# Altium project 数字电路时钟.PrjPcb
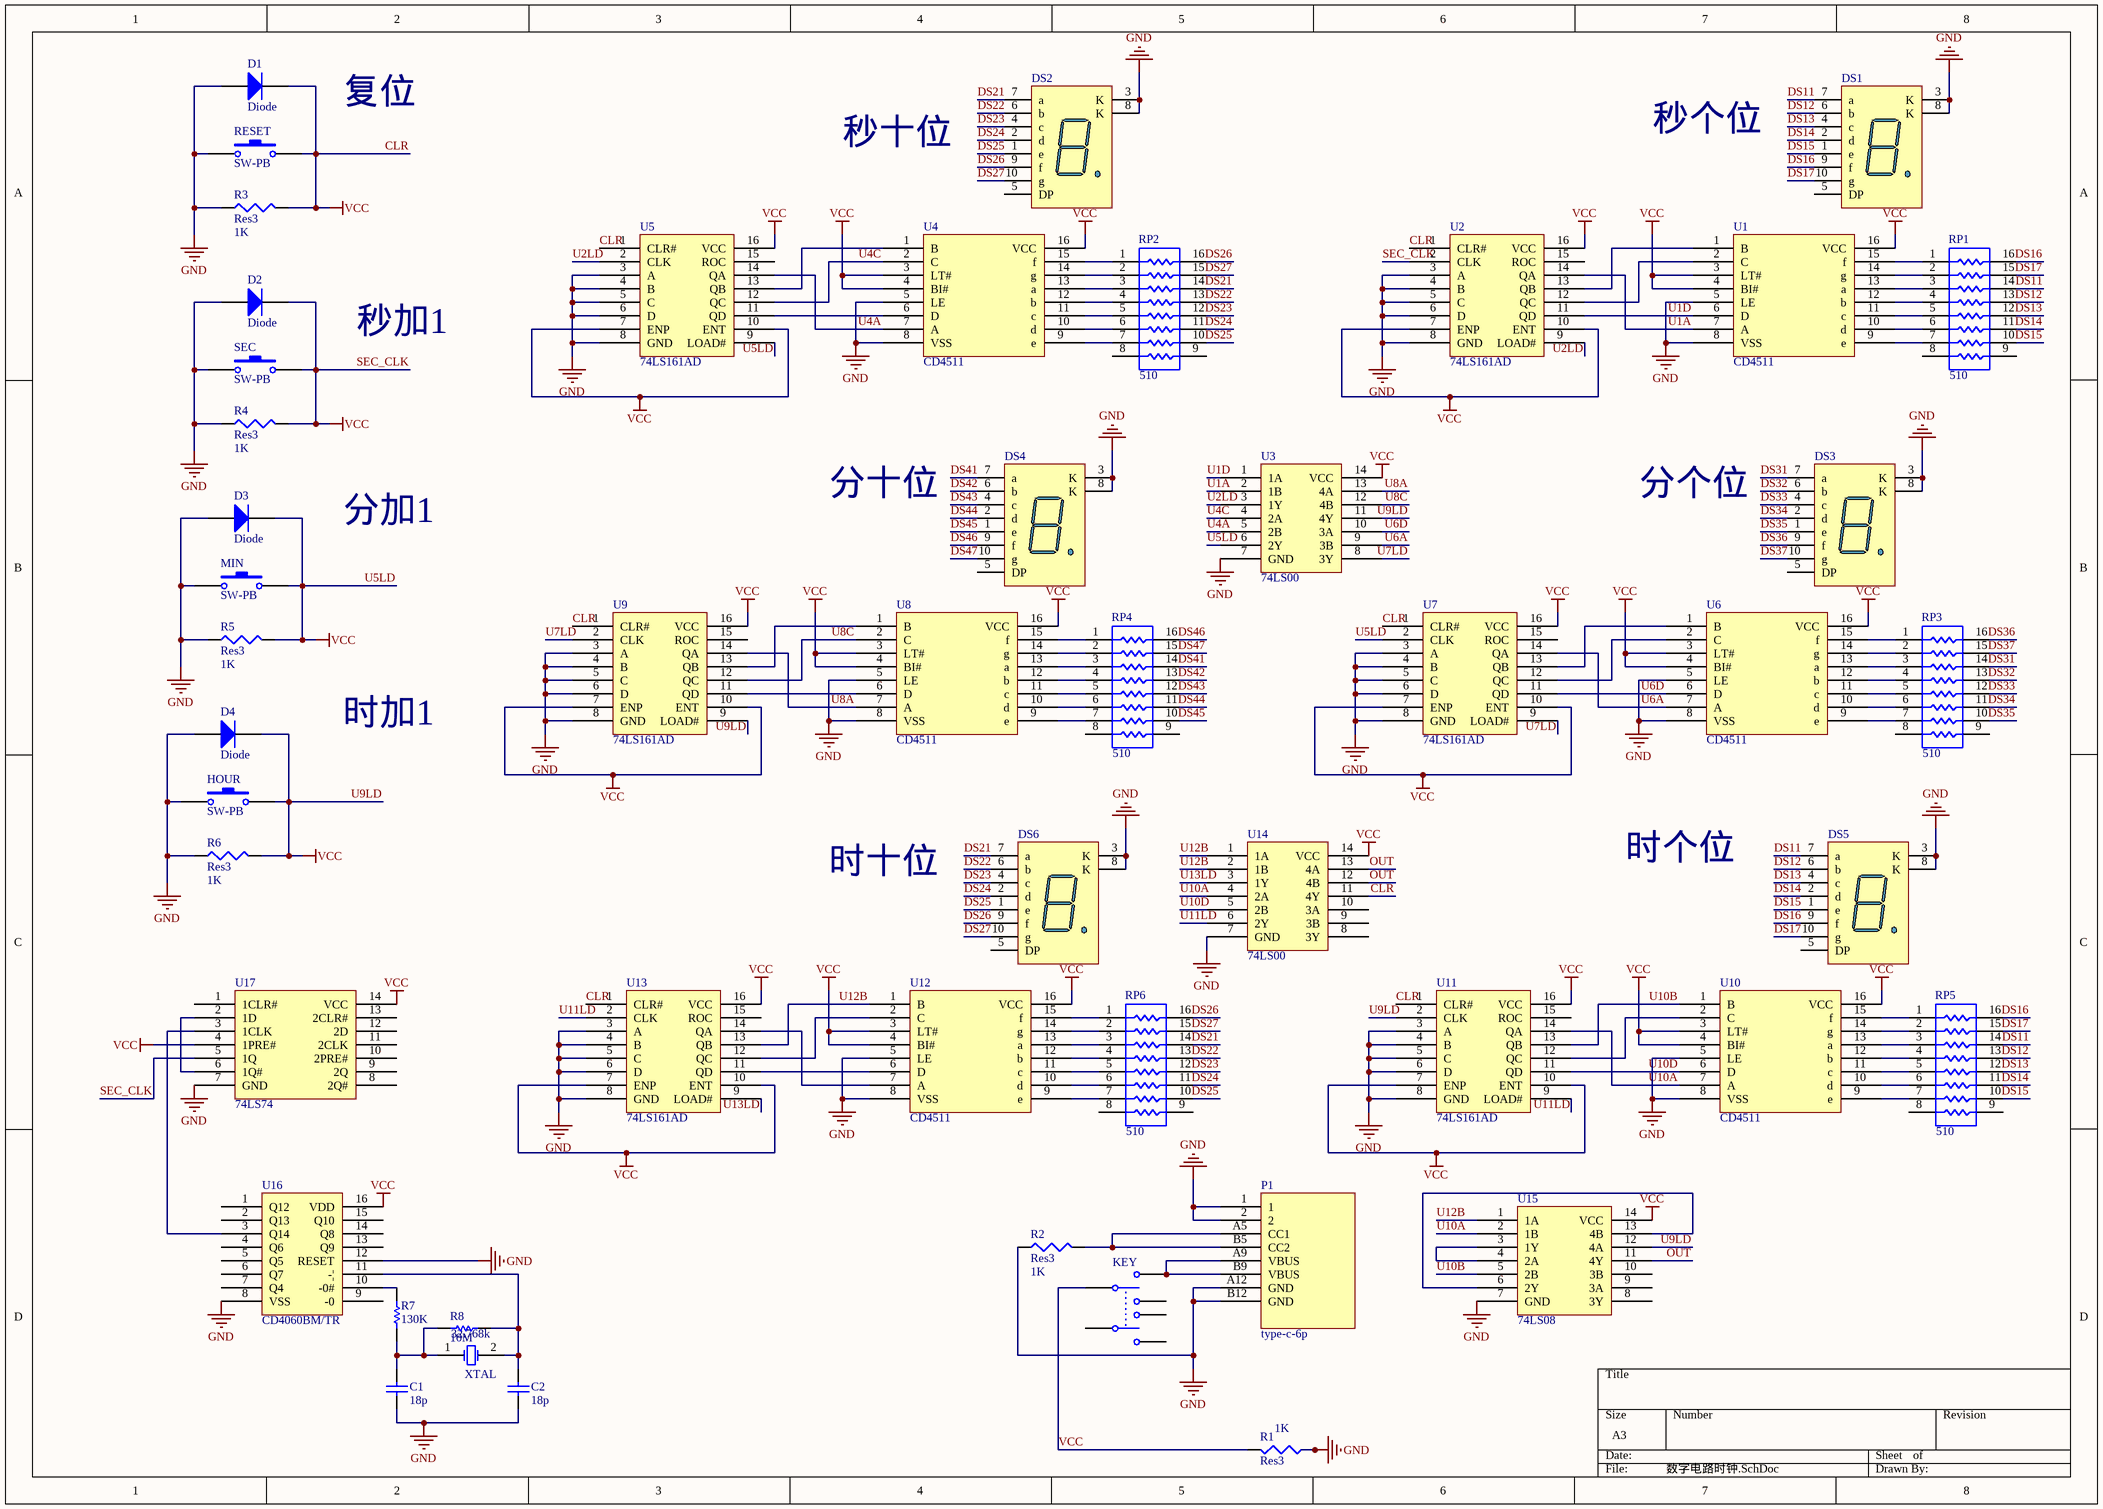
[diagram p0: 数字电路时钟.SchDoc]
1 sheet, 50 parts. Net scope: global (net labels, ports and power ports of the same name join across sheets).
Board file: 数字电路时钟.PcbDoc

## Sheet 数字电路时钟.SchDoc
size A3

### Parts
32.768k  XTAL  [R38]
C1  value 18p  [C1206]  (hidden comment: Cap Semi)
C2  value 18p  [C1206]  (hidden comment: Cap Semi)
D1  Diode  [SMC]
D2  Diode  [SMC]
D3  Diode  [SMC]
D4  Diode  [SMC]
DS1  Dpy Blue-CC  [H]  (value not drawn)
DS2  Dpy Blue-CC  [H]  (value not drawn)
DS3  Dpy Blue-CC  [H]  (value not drawn)
DS4  Dpy Blue-CC  [H]  (value not drawn)
DS5  Dpy Blue-CC  [H]  (value not drawn)
DS6  Dpy Blue-CC  [H]  (value not drawn)
HOUR  SW-PB  [SPST-2]
KEY  SW-DPDT  [SOT23-6_N]  (value not drawn)
MIN  SW-PB  [SPST-2]
P1  type-c-6p  [type-c-6p - duplicate]
R1  Res3  value 1K  [J1-0603]
R2  Res3  value 1K  [J1-0603]
R3  Res3  value 1K  [J1-0603]
R4  Res3  value 1K  [J1-0603]
R5  Res3  value 1K  [J1-0603]
R6  Res3  value 1K  [J1-0603]
R7  value 130K  [AXIAL-0.3]  (hidden comment: Res1)
R8  value 10M  [AXIAL-0.3]  (hidden comment: Res1)
RESET  SW-PB  [SPST-2]
RP1  value 510  [SO-16_N]  (hidden comment: Res Pack3)
RP2  value 510  [SO-16_N]  (hidden comment: Res Pack3)
RP3  value 510  [SO-16_N]  (hidden comment: Res Pack3)
RP4  value 510  [SO-16_N]  (hidden comment: Res Pack3)
RP5  value 510  [SO-16_N]  (hidden comment: Res Pack3)
RP6  value 510  [SO-16_N]  (hidden comment: Res Pack3)
SEC  SW-PB  [SPST-2]
U1  CD4511  [CD4511BM/TR]
U2  74LS161AD  [74LS161]
U3  74LS00  [74LS00]
U4  CD4511  [CD4511BM/TR]
U5  74LS161AD  [74LS161]
U6  CD4511  [CD4511BM/TR]
U7  74LS161AD  [74LS161]
U8  CD4511  [CD4511BM/TR]
U9  74LS161AD  [74LS161]
U10  CD4511  [CD4511BM/TR]
U11  74LS161AD  [74LS161]
U12  CD4511  [CD4511BM/TR]
U13  74LS161AD  [74LS161]
U14  74LS00  [74LS00]
U15  74LS08  [74LS08]
U16  CD4060BM/TR  [CD4060BM/TR]
U17  74LS74  [74LS74]

### Nets
CLR: D1.2(K) D2.2(K) D3.2(K) D4.2(K) HOUR.2 KEY.1 MIN.2 R1.2 R3.2 R4.2 R5.2 R6.2 RESET.2 SEC.2 U1.3(LT#) U1.4(BI#) U1.16(VCC) U2.1(CLR#) U2.2(CLK) U2.7(ENP) U2.10(ENT) U2.16(VCC) U3.6(2Y) U3.11(4Y) U3.14(VCC) U4.3(LT#) U4.4(BI#) U4.16(VCC) U5.1(CLR#) U5.7(ENP) U5.9(LOAD#) U5.10(ENT) U5.16(VCC) U6.3(LT#) U6.4(BI#) U6.16(VCC) U7.1(CLR#) U7.2(CLK) U7.7(ENP) U7.10(ENT) U7.16(VCC) U8.3(LT#) U8.4(BI#) U8.16(VCC) U9.1(CLR#) U9.7(ENP) U9.9(LOAD#) U9.10(ENT) U9.16(VCC) U10.3(LT#) U10.4(BI#) U10.16(VCC) U11.1(CLR#) U11.2(CLK) U11.7(ENP) U11.10(ENT) U11.16(VCC) U12.3(LT#) U12.4(BI#) U12.16(VCC) U13.1(CLR#) U13.7(ENP) U13.10(ENT) U13.16(VCC) U14.11(4Y) U14.14(VCC) U15.12(4A) U15.14(VCC) U16.16(VDD) U17.4(1PRE#) U17.5(1Q) U17.14(VCC)  [also labelled SEC_CLK, U5LD, U9LD, VCC]
GND: C1.1 C2.1 D1.1(A) D2.1(A) D3.1(A) D4.1(A) DS1.3(K) DS1.8(K) DS2.3(K) DS2.8(K) DS3.3(K) DS3.8(K) DS4.3(K) DS4.8(K) DS5.3(K) DS5.8(K) DS6.3(K) DS6.8(K) HOUR.1 MIN.1 P1.1 P1.2 P1.A12(GND) P1.B12(GND) R1.1 R2.1 R3.1 R4.1 R5.1 R6.1 RESET.1 SEC.1 U1.5(LE) U1.8(VSS) U2.3(A) U2.4(B) U2.5(C) U2.6(D) U2.8(GND) U3.7(GND) U4.5(LE) U4.8(VSS) U5.3(A) U5.4(B) U5.5(C) U5.6(D) U5.8(GND) U6.5(LE) U6.8(VSS) U7.3(A) U7.4(B) U7.5(C) U7.6(D) U7.8(GND) U8.5(LE) U8.8(VSS) U9.3(A) U9.4(B) U9.5(C) U9.6(D) U9.8(GND) U10.5(LE) U10.8(VSS) U11.3(A) U11.4(B) U11.5(C) U11.6(D) U11.8(GND) U12.5(LE) U12.8(VSS) U13.3(A) U13.4(B) U13.5(C) U13.6(D) U13.8(GND) U14.7(GND) U15.7(GND) U16.8(VSS) U16.12(RESET) U17.7(GND)
DS11: DS1.7(a) DS5.7(a) RP1.14 RP5.14
DS12: DS1.6(b) DS5.6(b) RP1.13 RP5.13
DS13: DS1.4(c) DS5.4(c) RP1.12 RP5.12
DS14: DS1.2(d) DS5.2(d) RP1.11 RP5.11
DS15: DS1.1(e) DS5.1(e) RP1.10 RP5.10
DS16: DS1.9(f) DS5.9(f) RP1.16 RP5.16
DS17: DS1.10(g) DS5.10(g) RP1.15 RP5.15
DS21: DS2.7(a) DS6.7(a) RP2.14 RP6.14
DS22: DS2.6(b) DS6.6(b) RP2.13 RP6.13
DS23: DS2.4(c) DS6.4(c) RP2.12 RP6.12
DS24: DS2.2(d) DS6.2(d) RP2.11 RP6.11
DS25: DS2.1(e) DS6.1(e) RP2.10 RP6.10
DS26: DS2.9(f) DS6.9(f) RP2.16 RP6.16
DS27: DS2.10(g) DS6.10(g) RP2.15 RP6.15
DS31: DS3.7(a) RP3.14
DS32: DS3.6(b) RP3.13
DS33: DS3.4(c) RP3.12
DS34: DS3.2(d) RP3.11
DS35: DS3.1(e) RP3.10
DS36: DS3.9(f) RP3.16
DS37: DS3.10(g) RP3.15
DS41: DS4.7(a) RP4.14
DS42: DS4.6(b) RP4.13
DS43: DS4.4(c) RP4.12
DS44: DS4.2(d) RP4.11
DS45: DS4.1(e) RP4.10
DS46: DS4.9(f) RP4.16
DS47: DS4.10(g) RP4.15
OUT: U14.12(4B) U14.13(4A) U15.11(4Y)
U1A: U1.7(A) U2.14(QA) U3.2(1B)
U1D: U1.6(D) U2.11(QD) U3.1(1A)
U2LD: U2.9(LOAD#) U3.3(1Y) U5.2(CLK)
U4A: U3.5(2B) U4.7(A) U5.14(QA)
U4C: U3.4(2A) U4.2(C) U5.12(QC)
U6A: U3.9(3B) U6.7(A) U7.14(QA)
U6D: U3.10(3A) U6.6(D) U7.11(QD)
U7LD: U3.8(3Y) U7.9(LOAD#) U9.2(CLK)
U8A: U3.13(4A) U8.7(A) U9.14(QA)
U8C: U3.12(4B) U8.2(C) U9.12(QC)
U10A: U10.7(A) U11.14(QA) U14.4(2A) U15.2(1B)
U10B: U10.1(B) U11.13(QB) U15.5(2B)
U10D: U10.6(D) U11.11(QD) U14.5(2B)
U11LD: U11.9(LOAD#) U13.2(CLK) U14.6(2Y)
U12B: U12.1(B) U13.13(QB) U14.1(1A) U14.2(1B) U15.1(1A)
U13LD: U13.9(LOAD#) U14.3(1Y)
Net32.768k_1: 32.768k.1(OSC1) C1.2 R7.2 R8.1
Net32.768k_2: 32.768k.2(OSC2) C2.2 R8.2 U16.11(-|)
NetKEY_2: KEY.2 P1.A9(VBUS) P1.B9(VBUS)
NetP1_A5: P1.A5(CC1) P1.B5(CC2) R2.2
NetR7_1: R7.1 U16.10(-0#)
NetRP1_1: RP1.1 U1.15(f)
NetRP1_2: RP1.2 U1.14(g)
NetRP1_3: RP1.3 U1.13(a)
NetRP1_4: RP1.4 U1.12(b)
NetRP1_5: RP1.5 U1.11(c)
NetRP1_6: RP1.6 U1.10(d)
NetRP1_7: RP1.7 U1.9(e)
NetRP2_1: RP2.1 U4.15(f)
NetRP2_2: RP2.2 U4.14(g)
NetRP2_3: RP2.3 U4.13(a)
NetRP2_4: RP2.4 U4.12(b)
NetRP2_5: RP2.5 U4.11(c)
NetRP2_6: RP2.6 U4.10(d)
NetRP2_7: RP2.7 U4.9(e)
NetRP3_1: RP3.1 U6.15(f)
NetRP3_2: RP3.2 U6.14(g)
NetRP3_3: RP3.3 U6.13(a)
NetRP3_4: RP3.4 U6.12(b)
NetRP3_5: RP3.5 U6.11(c)
NetRP3_6: RP3.6 U6.10(d)
NetRP3_7: RP3.7 U6.9(e)
NetRP4_1: RP4.1 U8.15(f)
NetRP4_2: RP4.2 U8.14(g)
NetRP4_3: RP4.3 U8.13(a)
NetRP4_4: RP4.4 U8.12(b)
NetRP4_5: RP4.5 U8.11(c)
NetRP4_6: RP4.6 U8.10(d)
NetRP4_7: RP4.7 U8.9(e)
NetRP5_1: RP5.1 U10.15(f)
NetRP5_2: RP5.2 U10.14(g)
NetRP5_3: RP5.3 U10.13(a)
NetRP5_4: RP5.4 U10.12(b)
NetRP5_5: RP5.5 U10.11(c)
NetRP5_6: RP5.6 U10.10(d)
NetRP5_7: RP5.7 U10.9(e)
NetRP6_1: RP6.1 U12.15(f)
NetRP6_2: RP6.2 U12.14(g)
NetRP6_3: RP6.3 U12.13(a)
NetRP6_4: RP6.4 U12.12(b)
NetRP6_5: RP6.5 U12.11(c)
NetRP6_6: RP6.6 U12.10(d)
NetRP6_7: RP6.7 U12.9(e)
NetU1_1: U1.1(B) U2.13(QB)
NetU1_2: U1.2(C) U2.12(QC)
NetU4_1: U4.1(B) U5.13(QB)
NetU4_6: U4.6(D) U5.11(QD)
NetU6_1: U6.1(B) U7.13(QB)
NetU6_2: U6.2(C) U7.12(QC)
NetU8_1: U8.1(B) U9.13(QB)
NetU8_6: U8.6(D) U9.11(QD)
NetU10_2: U10.2(C) U11.12(QC)
NetU12_2: U12.2(C) U13.12(QC)
NetU12_6: U12.6(D) U13.11(QD)
NetU12_7: U12.7(A) U13.14(QA)
NetU15_3: U15.3(1Y) U15.4(2A)
NetU15_6: U15.6(2Y) U15.13(4B)
NetU16_3: U16.3(Q14) U17.3(1CLK)
NetU17_2: U17.2(1D) U17.6(1Q#)

Not connected (* = marked no-connect by the designer): DS1 5(DP); DS2 5(DP); DS3 5(DP); DS4 5(DP); DS5 5(DP); DS6 5(DP); KEY 3 4 5 6; RP1 8 9; RP2 8 9; RP3 8 9; RP4 8 9; RP5 8 9; RP6 8 9; U2 15(ROC); U5 15(ROC); U7 15(ROC); U9 15(ROC); U11 15(ROC); U13 15(ROC); U14 8(3Y) 9(3B) 10(3A); U15 8(3Y) 9(3A) 10(3B); U16 1(Q12) 2(Q13) 4(Q6) 5(Q5) 6(Q7) 7(Q4) 9(-0) 13(Q9) 14(Q8) 15(Q10); U17 1(1CLR#) 8(2Q#) 9(2Q) 10(2PRE#) 11(2CLK) 12(2D) 13(2CLR#)

### Notes on the sheet
- 复位
- 秒十位
- 秒个位
- 秒加1
- 分十位
- 分个位
- 分加1
- 时加1
- 时十位
- 时个位

### Library data of the parts
32.768k = XTAL: Crystal Oscillator; Published: 8-Jun-2000; LatestRevisionDate: 17-Jul-2002; LatestRevisionNote: Re-released for DXP Platform.; PackageReference: R38; Publisher: Altium Limited; PackageDescription: Crystal, Thru-Hole; 2 Leads; Body 3.1 x 8.2 mm (Dia.xH)
C1 C2 = Cap Semi: Capacitor (Semiconductor SIM Model); Published: 8-Jun-2000; LatestRevisionDate: 29-May-2009; LatestRevisionNote: IPC-7351 Footprint Added.; PackageReference: C1206; Publisher: Altium Limited; PackageDescription: Chip Capacitor
D1-D4 = Diode: Default Diode; Published: 8-Jun-2000; LatestRevisionDate: 17-Jul-2002; LatestRevisionNote: Re-released for DXP Platform.; PackageVersion: Sep-1996; PackageReference: SMC; Publisher: Altium Limited; PackageDescription: DO-214-AB/SMC; 2 C-Bend Leads; Body 7.9 x 5.9 mm, inc. leads (LxW); Code_JEDEC: DO-214-AB
DS1-DS6 = Dpy Blue-CC: 14.2 mm General Purpose Blue 7-Segment Display: CC, RH DP, Gray Surface; MinimumIntensity: 2020 ucd; Note: IF = 10 mA; Published: 8-Jun-2000; LatestRevisionDate: 17-Dec-2003; LatestRevisionNote: Schematic revised, PCB Footprint replaced.; DatasheetVersion: 24-Sep-2002; PackageVersion: 24-Sep-2002; PackageReference: H; Publisher: Altium Limited; PackageDescription: LED, 7-Segment Display, 14.2 mm, RHD; 10 Leads; Row Space 15.24 mm; Pitch 2.54 mm; Colour: Blue; ComponentLink1Description: Manufacturer Link; ComponentLink1URL: http://www.agilent.com/
HOUR MIN RESET SEC = SW-PB: Switch; Published: 24-Mar-1999; LatestRevisionDate: 17-Jul-2002; LatestRevisionNote: Re-released for DXP Platform.; PackageReference: SPST-2; Publisher: Altium Limited; PackageDescription: Switch; 2 Leads
KEY = SW-DPDT: Double-Pole, Double-Throw Switch; Published: 24-Mar-1999; LatestRevisionDate: 17-Jul-2002; LatestRevisionNote: Re-released for DXP Platform.; PackageReference: DPDT-6; Publisher: Altium Limited; PackageDescription: Switch; 6 Leads
R1-R6 = Res3: Resistor; Published: 8-Jun-2000; LatestRevisionDate: 29-May-2009; LatestRevisionNote: IPC-7351 Footprint Added.; PackageReference: J1-0603; Publisher: Altium Limited; PackageDescription: Chip Resistor
R7 R8 = Res1: Resistor; Published: 8-Jun-2000; LatestRevisionDate: 17-Jul-2002; LatestRevisionNote: Re-released for DXP Platform.; PackageReference: AXIAL-0.3; Publisher: Altium Limited; PackageDescription: Axial Device, Thru-Hole; 2 Leads; 0.3 in Pin Spacing
RP1-RP6 = Res Pack3: Isolated Resistor Network; Published: 24-Mar-1999; LatestRevisionDate: 29-May-2009; LatestRevisionNote: IPC-7351 Footprint Added.; PackageReference: SO-16; Publisher: Altium Limited; PackageDescription: 16-Pin Small Outline Integrated Circuit 1.27 mm Pitch; Code_JEDEC: MS-012-AC; Code_IPC: SOIC127P600-16